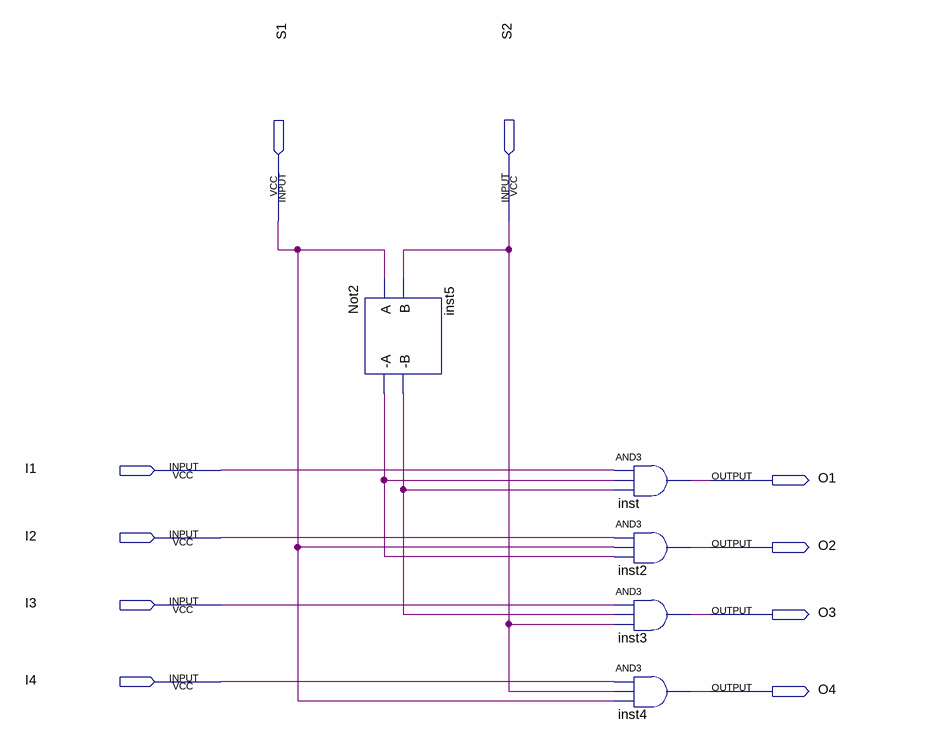
[diagram p0: schematic sheet]
// Quartus schematic multiplexor.bdf as structural Verilog: 5 symbols, 10 pins
module multiplexor (
  input  S1,
  input  S2,
  input  I1,
  input  I2,
  input  I3,
  input  I4,
  output O1,
  output O2,
  output O3,
  output O4
);

  wire inst5__a, inst5__b;

  Not2 inst5 (.A(S1), .B(S2), .\-A (inst5__a), .\-B (inst5__b));
  and inst (O1, I1, inst5__a, inst5__b);
  and inst2 (O2, I2, S1, inst5__a);
  and inst3 (O3, I3, inst5__b, S2);
  and inst4 (O4, I4, S2, S1);
endmodule
